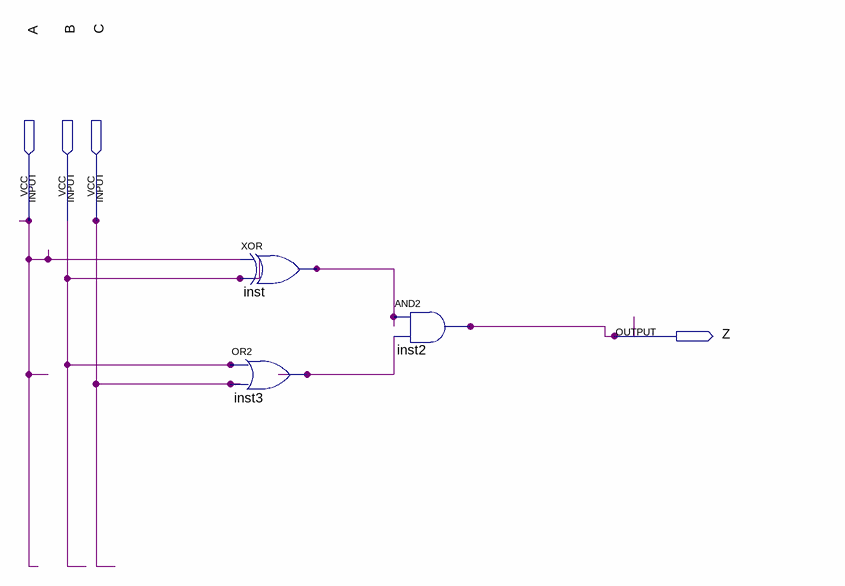
[diagram p0: schematic sheet]
// Quartus schematic DemoLogic.bdf as structural Verilog: 3 symbols, 4 pins
module DemoLogic (
  input  A,
  input  B,
  input  C,
  output Z
);

  wire inst3_out, inst_out;

  xor inst (inst_out, A, B);
  or inst3 (inst3_out, B, C);
  and inst2 (Z, inst_out, inst3_out);
endmodule
